# Altium schematic sheet ZYNQ-PL.SchDoc
size A3; SheetNumber: 4; SheetTotal: 9
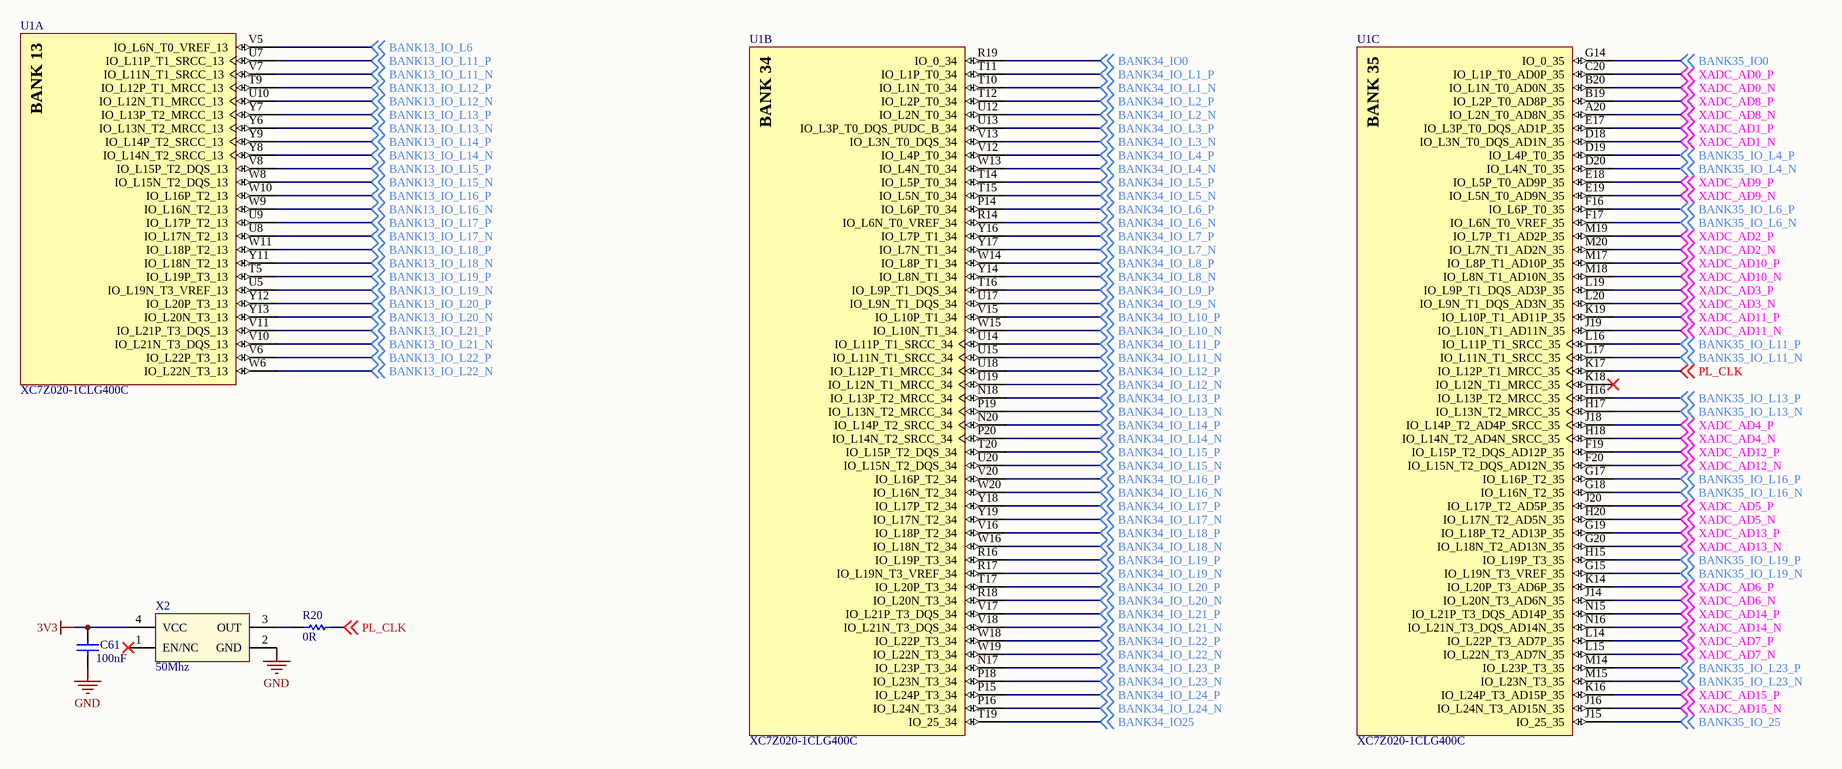
[diagram p0: ZYNQ-PL.SchDoc]

## Parts
C61  100nF  [CAPC1005X55X25LL05T10]
R20  0R  [RESC1005X40X25LL05T05]
U1  XC7Z020-1CLG400C  [CLG400]  (parts A,B,C of 9)
X2  50Mhz  [OSC-3225-4P]

## Nets
3V3: C61.2 X2.4(VCC)
GND: C61.1 X2.2(GND)
BANK13_IO_L6: U1.V5(IO_L6N_T0_VREF_13) ; off-sheet BANK13_IO_L6
BANK13_IO_L11_N: U1.V7(IO_L11N_T1_SRCC_13) ; off-sheet BANK13_IO_L11_N
BANK13_IO_L11_P: U1.U7(IO_L11P_T1_SRCC_13) ; off-sheet BANK13_IO_L11_P
BANK13_IO_L12_N: U1.U10(IO_L12N_T1_MRCC_13) ; off-sheet BANK13_IO_L12_N
BANK13_IO_L12_P: U1.T9(IO_L12P_T1_MRCC_13) ; off-sheet BANK13_IO_L12_P
BANK13_IO_L13_N: U1.Y6(IO_L13N_T2_MRCC_13) ; off-sheet BANK13_IO_L13_N
BANK13_IO_L13_P: U1.Y7(IO_L13P_T2_MRCC_13) ; off-sheet BANK13_IO_L13_P
BANK13_IO_L14_N: U1.Y8(IO_L14N_T2_SRCC_13) ; off-sheet BANK13_IO_L14_N
BANK13_IO_L14_P: U1.Y9(IO_L14P_T2_SRCC_13) ; off-sheet BANK13_IO_L14_P
BANK13_IO_L15_N: U1.W8(IO_L15N_T2_DQS_13) ; off-sheet BANK13_IO_L15_N
BANK13_IO_L15_P: U1.V8(IO_L15P_T2_DQS_13) ; off-sheet BANK13_IO_L15_P
BANK13_IO_L16_N: U1.W9(IO_L16N_T2_13) ; off-sheet BANK13_IO_L16_N
BANK13_IO_L16_P: U1.W10(IO_L16P_T2_13) ; off-sheet BANK13_IO_L16_P
BANK13_IO_L17_N: U1.U8(IO_L17N_T2_13) ; off-sheet BANK13_IO_L17_N
BANK13_IO_L17_P: U1.U9(IO_L17P_T2_13) ; off-sheet BANK13_IO_L17_P
BANK13_IO_L18_N: U1.Y11(IO_L18N_T2_13) ; off-sheet BANK13_IO_L18_N
BANK13_IO_L18_P: U1.W11(IO_L18P_T2_13) ; off-sheet BANK13_IO_L18_P
BANK13_IO_L19_N: U1.U5(IO_L19N_T3_VREF_13) ; off-sheet BANK13_IO_L19_N
BANK13_IO_L19_P: U1.T5(IO_L19P_T3_13) ; off-sheet BANK13_IO_L19_P
BANK13_IO_L20_N: U1.Y13(IO_L20N_T3_13) ; off-sheet BANK13_IO_L20_N
BANK13_IO_L20_P: U1.Y12(IO_L20P_T3_13) ; off-sheet BANK13_IO_L20_P
BANK13_IO_L21_N: U1.V10(IO_L21N_T3_DQS_13) ; off-sheet BANK13_IO_L21_N
BANK13_IO_L21_P: U1.V11(IO_L21P_T3_DQS_13) ; off-sheet BANK13_IO_L21_P
BANK13_IO_L22_N: U1.W6(IO_L22N_T3_13) ; off-sheet BANK13_IO_L22_N
BANK13_IO_L22_P: U1.V6(IO_L22P_T3_13) ; off-sheet BANK13_IO_L22_P
BANK34_IO0: U1.R19(IO_0_34) ; off-sheet BANK34_IO0
BANK34_IO25: U1.T19(IO_25_34) ; off-sheet BANK34_IO25
BANK34_IO_L1_N: U1.T10(IO_L1N_T0_34) ; off-sheet BANK34_IO_L1_N
BANK34_IO_L1_P: U1.T11(IO_L1P_T0_34) ; off-sheet BANK34_IO_L1_P
BANK34_IO_L2_N: U1.U12(IO_L2N_T0_34) ; off-sheet BANK34_IO_L2_N
BANK34_IO_L2_P: U1.T12(IO_L2P_T0_34) ; off-sheet BANK34_IO_L2_P
BANK34_IO_L3_N: U1.V13(IO_L3N_T0_DQS_34) ; off-sheet BANK34_IO_L3_N
BANK34_IO_L3_P: U1.U13(IO_L3P_T0_DQS_PUDC_B_34) ; off-sheet BANK34_IO_L3_P
BANK34_IO_L4_N: U1.W13(IO_L4N_T0_34) ; off-sheet BANK34_IO_L4_N
BANK34_IO_L4_P: U1.V12(IO_L4P_T0_34) ; off-sheet BANK34_IO_L4_P
BANK34_IO_L5_N: U1.T15(IO_L5N_T0_34) ; off-sheet BANK34_IO_L5_N
BANK34_IO_L5_P: U1.T14(IO_L5P_T0_34) ; off-sheet BANK34_IO_L5_P
BANK34_IO_L6_N: U1.R14(IO_L6N_T0_VREF_34) ; off-sheet BANK34_IO_L6_N
BANK34_IO_L6_P: U1.P14(IO_L6P_T0_34) ; off-sheet BANK34_IO_L6_P
BANK34_IO_L7_N: U1.Y17(IO_L7N_T1_34) ; off-sheet BANK34_IO_L7_N
BANK34_IO_L7_P: U1.Y16(IO_L7P_T1_34) ; off-sheet BANK34_IO_L7_P
BANK34_IO_L8_N: U1.Y14(IO_L8N_T1_34) ; off-sheet BANK34_IO_L8_N
BANK34_IO_L8_P: U1.W14(IO_L8P_T1_34) ; off-sheet BANK34_IO_L8_P
BANK34_IO_L9_N: U1.U17(IO_L9N_T1_DQS_34) ; off-sheet BANK34_IO_L9_N
BANK34_IO_L9_P: U1.T16(IO_L9P_T1_DQS_34) ; off-sheet BANK34_IO_L9_P
BANK34_IO_L10_N: U1.W15(IO_L10N_T1_34) ; off-sheet BANK34_IO_L10_N
BANK34_IO_L10_P: U1.V15(IO_L10P_T1_34) ; off-sheet BANK34_IO_L10_P
BANK34_IO_L11_N: U1.U15(IO_L11N_T1_SRCC_34) ; off-sheet BANK34_IO_L11_N
BANK34_IO_L11_P: U1.U14(IO_L11P_T1_SRCC_34) ; off-sheet BANK34_IO_L11_P
BANK34_IO_L12_N: U1.U19(IO_L12N_T1_MRCC_34) ; off-sheet BANK34_IO_L12_N
BANK34_IO_L12_P: U1.U18(IO_L12P_T1_MRCC_34) ; off-sheet BANK34_IO_L12_P
BANK34_IO_L13_N: U1.P19(IO_L13N_T2_MRCC_34) ; off-sheet BANK34_IO_L13_N
BANK34_IO_L13_P: U1.N18(IO_L13P_T2_MRCC_34) ; off-sheet BANK34_IO_L13_P
BANK34_IO_L14_N: U1.P20(IO_L14N_T2_SRCC_34) ; off-sheet BANK34_IO_L14_N
BANK34_IO_L14_P: U1.N20(IO_L14P_T2_SRCC_34) ; off-sheet BANK34_IO_L14_P
BANK34_IO_L15_N: U1.U20(IO_L15N_T2_DQS_34) ; off-sheet BANK34_IO_L15_N
BANK34_IO_L15_P: U1.T20(IO_L15P_T2_DQS_34) ; off-sheet BANK34_IO_L15_P
BANK34_IO_L16_N: U1.W20(IO_L16N_T2_34) ; off-sheet BANK34_IO_L16_N
BANK34_IO_L16_P: U1.V20(IO_L16P_T2_34) ; off-sheet BANK34_IO_L16_P
BANK34_IO_L17_N: U1.Y19(IO_L17N_T2_34) ; off-sheet BANK34_IO_L17_N
BANK34_IO_L17_P: U1.Y18(IO_L17P_T2_34) ; off-sheet BANK34_IO_L17_P
BANK34_IO_L18_N: U1.W16(IO_L18N_T2_34) ; off-sheet BANK34_IO_L18_N
BANK34_IO_L18_P: U1.V16(IO_L18P_T2_34) ; off-sheet BANK34_IO_L18_P
BANK34_IO_L19_N: U1.R17(IO_L19N_T3_VREF_34) ; off-sheet BANK34_IO_L19_N
BANK34_IO_L19_P: U1.R16(IO_L19P_T3_34) ; off-sheet BANK34_IO_L19_P
BANK34_IO_L20_N: U1.R18(IO_L20N_T3_34) ; off-sheet BANK34_IO_L20_N
BANK34_IO_L20_P: U1.T17(IO_L20P_T3_34) ; off-sheet BANK34_IO_L20_P
BANK34_IO_L21_N: U1.V18(IO_L21N_T3_DQS_34) ; off-sheet BANK34_IO_L21_N
BANK34_IO_L21_P: U1.V17(IO_L21P_T3_DQS_34) ; off-sheet BANK34_IO_L21_P
BANK34_IO_L22_N: U1.W19(IO_L22N_T3_34) ; off-sheet BANK34_IO_L22_N
BANK34_IO_L22_P: U1.W18(IO_L22P_T3_34) ; off-sheet BANK34_IO_L22_P
BANK34_IO_L23_N: U1.P18(IO_L23N_T3_34) ; off-sheet BANK34_IO_L23_N
BANK34_IO_L23_P: U1.N17(IO_L23P_T3_34) ; off-sheet BANK34_IO_L23_P
BANK34_IO_L24_N: U1.P16(IO_L24N_T3_34) ; off-sheet BANK34_IO_L24_N
BANK34_IO_L24_P: U1.P15(IO_L24P_T3_34) ; off-sheet BANK34_IO_L24_P
BANK35_IO0: U1.G14(IO_0_35) ; off-sheet BANK35_IO0
BANK35_IO_25: U1.J15(IO_25_35) ; off-sheet BANK35_IO_25
BANK35_IO_L4_N: U1.D20(IO_L4N_T0_35) ; off-sheet BANK35_IO_L4_N
BANK35_IO_L4_P: U1.D19(IO_L4P_T0_35) ; off-sheet BANK35_IO_L4_P
BANK35_IO_L6_N: U1.F17(IO_L6N_T0_VREF_35) ; off-sheet BANK35_IO_L6_N
BANK35_IO_L6_P: U1.F16(IO_L6P_T0_35) ; off-sheet BANK35_IO_L6_P
BANK35_IO_L11_N: U1.L17(IO_L11N_T1_SRCC_35) ; off-sheet BANK35_IO_L11_N
BANK35_IO_L11_P: U1.L16(IO_L11P_T1_SRCC_35) ; off-sheet BANK35_IO_L11_P
BANK35_IO_L13_N: U1.H17(IO_L13N_T2_MRCC_35) ; off-sheet BANK35_IO_L13_N
BANK35_IO_L13_P: U1.H16(IO_L13P_T2_MRCC_35) ; off-sheet BANK35_IO_L13_P
BANK35_IO_L16_N: U1.G18(IO_L16N_T2_35) ; off-sheet BANK35_IO_L16_N
BANK35_IO_L16_P: U1.G17(IO_L16P_T2_35) ; off-sheet BANK35_IO_L16_P
BANK35_IO_L19_N: U1.G15(IO_L19N_T3_VREF_35) ; off-sheet BANK35_IO_L19_N
BANK35_IO_L19_P: U1.H15(IO_L19P_T3_35) ; off-sheet BANK35_IO_L19_P
BANK35_IO_L23_N: U1.M15(IO_L23N_T3_35) ; off-sheet BANK35_IO_L23_N
BANK35_IO_L23_P: U1.M14(IO_L23P_T3_35) ; off-sheet BANK35_IO_L23_P
PL_CLK: R20.2 U1.K17(IO_L12P_T1_MRCC_35) ; off-sheet PL_CLK
XADC_AD0_N: U1.B20(IO_L1N_T0_AD0N_35) ; off-sheet XADC_AD0_N
XADC_AD0_P: U1.C20(IO_L1P_T0_AD0P_35) ; off-sheet XADC_AD0_P
XADC_AD1_N: U1.D18(IO_L3N_T0_DQS_AD1N_35) ; off-sheet XADC_AD1_N
XADC_AD1_P: U1.E17(IO_L3P_T0_DQS_AD1P_35) ; off-sheet XADC_AD1_P
XADC_AD2_N: U1.M20(IO_L7N_T1_AD2N_35) ; off-sheet XADC_AD2_N
XADC_AD2_P: U1.M19(IO_L7P_T1_AD2P_35) ; off-sheet XADC_AD2_P
XADC_AD3_N: U1.L20(IO_L9N_T1_DQS_AD3N_35) ; off-sheet XADC_AD3_N
XADC_AD3_P: U1.L19(IO_L9P_T1_DQS_AD3P_35) ; off-sheet XADC_AD3_P
XADC_AD4_N: U1.H18(IO_L14N_T2_AD4N_SRCC_35) ; off-sheet XADC_AD4_N
XADC_AD4_P: U1.J18(IO_L14P_T2_AD4P_SRCC_35) ; off-sheet XADC_AD4_P
XADC_AD5_N: U1.H20(IO_L17N_T2_AD5N_35) ; off-sheet XADC_AD5_N
XADC_AD5_P: U1.J20(IO_L17P_T2_AD5P_35) ; off-sheet XADC_AD5_P
XADC_AD6_N: U1.J14(IO_L20N_T3_AD6N_35) ; off-sheet XADC_AD6_N
XADC_AD6_P: U1.K14(IO_L20P_T3_AD6P_35) ; off-sheet XADC_AD6_P
XADC_AD7_N: U1.L15(IO_L22N_T3_AD7N_35) ; off-sheet XADC_AD7_N
XADC_AD7_P: U1.L14(IO_L22P_T3_AD7P_35) ; off-sheet XADC_AD7_P
XADC_AD8_N: U1.A20(IO_L2N_T0_AD8N_35) ; off-sheet XADC_AD8_N
XADC_AD8_P: U1.B19(IO_L2P_T0_AD8P_35) ; off-sheet XADC_AD8_P
XADC_AD9_N: U1.E19(IO_L5N_T0_AD9N_35) ; off-sheet XADC_AD9_N
XADC_AD9_P: U1.E18(IO_L5P_T0_AD9P_35) ; off-sheet XADC_AD9_P
XADC_AD10_N: U1.M18(IO_L8N_T1_AD10N_35) ; off-sheet XADC_AD10_N
XADC_AD10_P: U1.M17(IO_L8P_T1_AD10P_35) ; off-sheet XADC_AD10_P
XADC_AD11_N: U1.J19(IO_L10N_T1_AD11N_35) ; off-sheet XADC_AD11_N
XADC_AD11_P: U1.K19(IO_L10P_T1_AD11P_35) ; off-sheet XADC_AD11_P
XADC_AD12_N: U1.F20(IO_L15N_T2_DQS_AD12N_35) ; off-sheet XADC_AD12_N
XADC_AD12_P: U1.F19(IO_L15P_T2_DQS_AD12P_35) ; off-sheet XADC_AD12_P
XADC_AD13_N: U1.G20(IO_L18N_T2_AD13N_35) ; off-sheet XADC_AD13_N
XADC_AD13_P: U1.G19(IO_L18P_T2_AD13P_35) ; off-sheet XADC_AD13_P
XADC_AD14_N: U1.N16(IO_L21N_T3_DQS_AD14N_35) ; off-sheet XADC_AD14_N
XADC_AD14_P: U1.N15(IO_L21P_T3_DQS_AD14P_35) ; off-sheet XADC_AD14_P
XADC_AD15_N: U1.J16(IO_L24N_T3_AD15N_35) ; off-sheet XADC_AD15_N
XADC_AD15_P: U1.K16(IO_L24P_T3_AD15P_35) ; off-sheet XADC_AD15_P
NetR20_1: R20.1 X2.3(OUT)

Not connected (* = marked no-connect by the designer): U1 K18(IO_L12N_T1_MRCC_35)*; X2 1(EN/NC)*

## Notes on the sheet
- (in symbol CMP-0363-00002-3, part A) BANK 13
- (in symbol CMP-0363-00002-3, part B) BANK 34
- (in symbol CMP-0363-00002-3, part C) BANK 35

## Library data of the parts
C61 = CMP-2008-04639-1: Part Number: GRM155R71H104KE14D; Manufacturer: Murata
R20 = CMP-2002-00921-1: Manufacturer: Panasonic; Part Number: ERJ-2RKF40R2X
U1 = CMP-0363-00002-3: 667 MHz Zynq™-7000 AP SoC, 130 PS I/O, 125 FPGA I/O, 400-Ball BGA, Speed Grade 1, Commercial Grade, Pb-Free; Flip Flops: 106400; Speed Grade: -1; LUTs: 53200; Extensible Block RAM (# 36Kb Blocks): 560 KB (140); PackageVersion: Rev 1.1, 09/2012; ComponentLink1Description: Datasheet; ComponentLink2Description: Package Specification; ComponentLink6Description: PCB and Layout Guide; PackageDescription: Wire-Bond Chip-Scale BGA, Body 17 x 17 mm, 0.8 mm Pitch; RoHS: Pb-Free; DatasheetVersion: v1.2; Mounting Technology: Surface Mount; ComponentLink5Description: Packaging and Pinout; ComponentLink5URL: http://www.xilinx.com/support/documentation/user_guides/ug865-Zynq-7000-Pkg-Pinout.pdf; ComponentLink6URL: http://www.xilinx.com/support/documentation/user_guides/ug483_7Series_PCB.pdf; Generic Part Number: XC7Z020; ComponentLink3Description: DC and AC Switching Characteristics; ComponentLink2URL: http://www.xilinx.com/support/documentation/user_guides/ug865-Zynq-7000-Pkg-Pinout.pdf; ComponentLink4Description: Package File; ComponentLink1URL: http://www.xilinx.com/support/documentation/data_sheets/ds190-Zynq-7000-Overview.pdf; PackageReference: CLG400; ComponentLink3URL: http://www.xilinx.com/support/documentation/data_sheets/ds187-XC7Z010-XC7Z020-Data-Sheet.pdf; PartNumber: XC7Z020-1CLG400C; ComponentLink4URL: http://www.xilinx.com/support/packagefiles/z7packages/xc7z020clg400pkg.txt; Code_JEDEC: MO-275-MMAA-1
X2 = XTAL-ACT-4P: 4脚有源晶振(振荡器); 联系下单店铺卖家 免费帮你查找封装: 联系下单店铺卖家 免费技术支持; BOM名称: 有源晶振(振荡器)